# EAGLE design wordclock-mainboard (EAGLE 6.4)
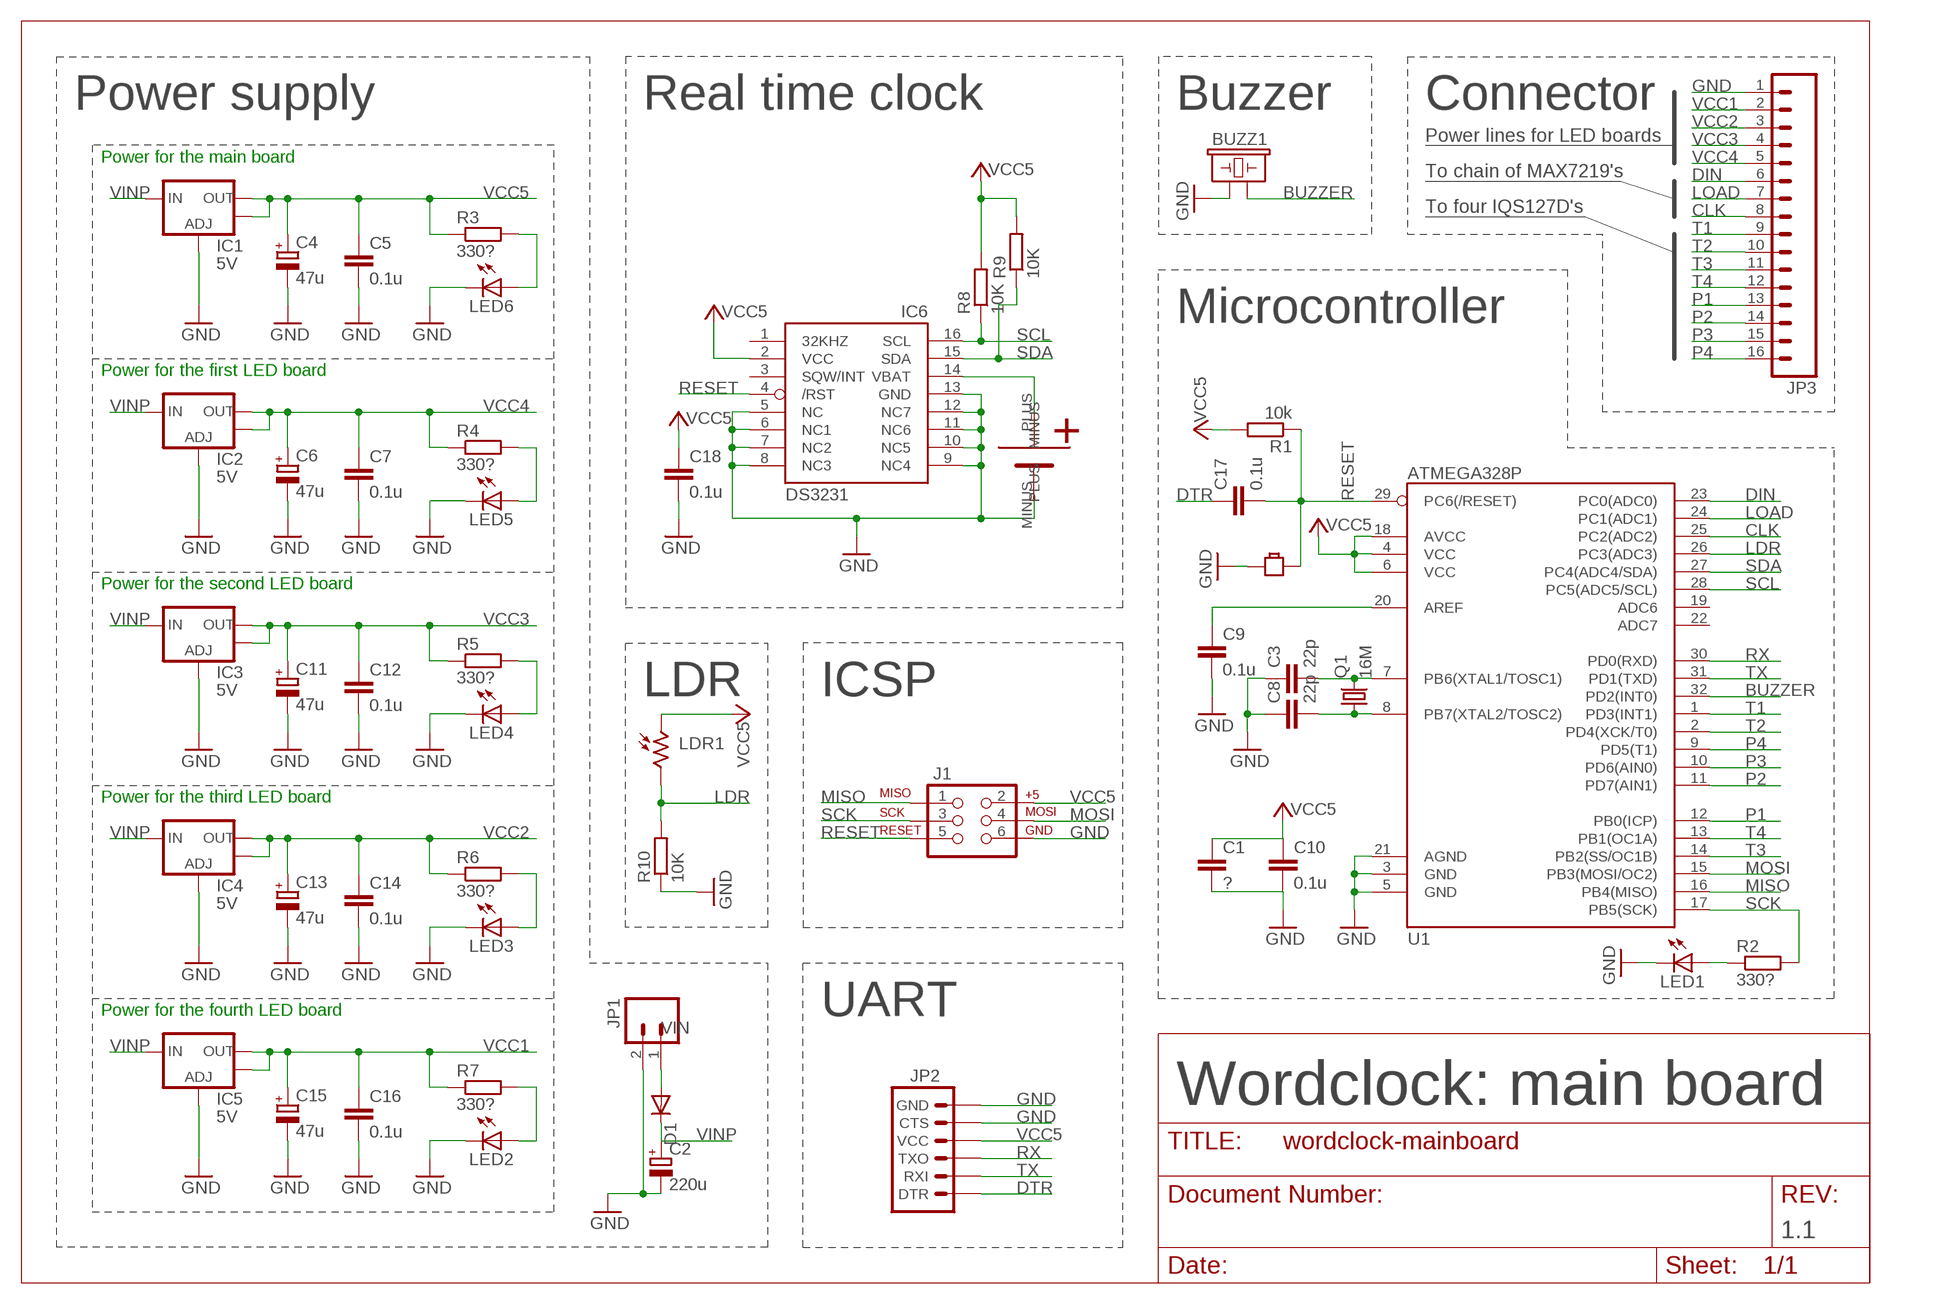
[diagram p0: schematic, sheet 1]

## Parts
BUZZ1  BUZZERPTH  [BUZZER-12MM]
C1  ?  C-EUC0805  [C0805]
C2  220u  CPOL-EUD  [PANASONIC_D]
C3  22p  C-EUC0805  [C0805]
C4  47u  CPOL-EUD  [PANASONIC_D]
C5  0.1u  C-EUC0805  [C0805]
C6  47u  CPOL-EUD  [PANASONIC_D]
C7  0.1u  C-EUC0805  [C0805]
C8  22p  C-EUC0805  [C0805]
C9  0.1u  C-EUC0805  [C0805]
C10  0.1u  C-EUC0805  [C0805]
C11  47u  CPOL-EUD  [PANASONIC_D]
C12  0.1u  C-EUC0805  [C0805]
C13  47u  CPOL-EUD  [PANASONIC_D]
C14  0.1u  C-EUC0805  [C0805]
C15  47u  CPOL-EUD  [PANASONIC_D]
C16  0.1u  C-EUC0805  [C0805]
C17  0.1u  C-EUC0805  [C0805]
C18  0.1u  C-EUC0805  [C0805]
D1  DIODE-DO-214AC  [DO-214AC]
IC1  5V  V_REG_LM1117SOT223  [SOT223]
IC2  5V  V_REG_LM1117SOT223  [SOT223]
IC3  5V  V_REG_LM1117SOT223  [SOT223]
IC4  5V  V_REG_LM1117SOT223  [SOT223]
IC5  5V  V_REG_LM1117SOT223  [SOT223]
IC6  DS3231/SO  [SO16W]
J1  AVR_SPI_PRG_6PTH  [2X3]
JP1  M02PTH  [1X02]
JP2  ARDUINO_SERIAL_PROGRAMPTH  [1X06]
JP3  M161X16_NO_SILK  [1X16_NO_SILK]
LDR1  A1050_09  [T0-46-A10XX]
LED1  LEDCHIPLED_0603  [CHIPLED_0603]
LED2  LEDCHIPLED_0603  [CHIPLED_0603]
LED3  LEDCHIPLED_0603  [CHIPLED_0603]
LED4  LEDCHIPLED_0603  [CHIPLED_0603]
LED5  LEDCHIPLED_0603  [CHIPLED_0603]
LED6  LEDCHIPLED_0603  [CHIPLED_0603]
Q1  16M  CSM-7X-DU  [CSM-7X-DU]
R1  10k  R-EU_R0603  [R0603]
R2  330?  R-EU_R0603  [R0603]
R3  330?  R-EU_R0603  [R0603]
R4  330?  R-EU_R0603  [R0603]
R5  330?  R-EU_R0603  [R0603]
R6  330?  R-EU_R0603  [R0603]
R7  330?  R-EU_R0603  [R0603]
R8  10K  R-EU_R0603  [R0603]
R9  10K  R-EU_R0603  [R0603]
R10  10K  R-EU_R0603  [R0603]
RESET  BUTTON-SMD-2P  [BUTTON_2P_SMD]
U1  ATMEGA328P  ATMEGA328_SMT  [TQFP32-08]
U$1  SMD-CR2032  [SMD-BATT]

## Nets
BUZZER: BUZZ1.- U1.32(PD2(INT0))
CLK: JP3.8 U1.25(PC2(ADC2))
DIN: JP3.6 U1.23(PC0(ADC0))
DTR: C17.1 JP2.1(DTR)
GND: BUZZ1.+ C1.2 C2.- C3.1 C4.- C5.2 C6.- C7.2 C8.1 C9.2 C10.2 C11.- C12.2 C13.- C14.2 C15.- C16.2 C18.2 IC1.1(ADJ) IC2.1(ADJ) IC3.1(ADJ) IC4.1(ADJ) IC5.1(ADJ) IC6.5(NC) IC6.6(NC1) IC6.7(NC2) IC6.8(NC3) IC6.9(NC4) IC6.10(NC5) IC6.11(NC6) IC6.12(NC7) IC6.13(GND) J1.6 JP1.2 JP2.5(CTS) JP2.6(GND) JP3.1 LED1.C LED2.C LED3.C LED4.C LED5.C LED6.C R10.1 RESET.1 U1.3(GND) U1.5(GND) U1.21(AGND) U$1.MINUS
LDR: LDR1.2 R10.2 U1.26(PC3(ADC3))
LOAD: JP3.7 U1.24(PC1(ADC1))
MISO: J1.1 U1.16(PB4(MISO))
MOSI: J1.4 U1.15(PB3(MOSI/OC2))
N$1: C3.2 Q1.2 U1.7(PB6(XTAL1/TOSC1))
N$3: C8.2 Q1.1 U1.8(PB7(XTAL2/TOSC2))
N$4: LED1.A R2.1
N$5: LED2.A R7.2
N$6: C9.1 U1.20(AREF)
N$7: LED3.A R6.2
N$8: LED4.A R5.2
N$9: LED6.A R3.2
N$10: LED5.A R4.2
N$12: IC6.14(VBAT) U$1.PLUS
P1: JP3.13 U1.12(PB0(ICP))
P2: JP3.14 U1.11(PD7(AIN1))
P3: JP3.15 U1.10(PD6(AIN0))
P4: JP3.16 U1.9(PD5(T1))
RESET: C17.2 IC6.4(/RST) J1.5 R1.1 RESET.P$2 U1.29(PC6(/RESET))
RX: JP2.3(TXO) U1.30(PD0(RXD))
SCK: J1.3 R2.2 U1.17(PB5(SCK))
SCL: IC6.16(SCL) R8.1 U1.28(PC5(ADC5/SCL))
SDA: IC6.15(SDA) R9.1 U1.27(PC4(ADC4/SDA))
T1: JP3.9 U1.1(PD3(INT1))
T2: JP3.10 U1.2(PD4(XCK/T0))
T3: JP3.11 U1.14(PB2(SS/OC1B))
T4: JP3.12 U1.13(PB1(OC1A))
TX: JP2.2(RXI) U1.31(PD1(TXD))
VCC1: C15.+ C16.1 IC5.2(OUT) IC5.4(OUT) JP3.2 R7.1
VCC2: C13.+ C14.1 IC4.2(OUT) IC4.4(OUT) JP3.3 R6.1
VCC3: C11.+ C12.1 IC3.2(OUT) IC3.4(OUT) JP3.4 R5.1
VCC4: C6.+ C7.1 IC2.2(OUT) IC2.4(OUT) JP3.5 R4.1
VCC5: C1.1 C4.+ C5.1 C10.1 C18.1 IC1.2(OUT) IC1.4(OUT) IC6.2(VCC) J1.2 JP2.4(VCC) LDR1.1 R1.2 R3.1 R8.2 R9.2 U1.4(VCC) U1.6(VCC) U1.18(AVCC)
VIN: D1.A JP1.1
VINP: C2.+ D1.C IC1.3(IN) IC2.3(IN) IC3.3(IN) IC4.3(IN) IC5.3(IN)
Unconnected: IC6.1(32KHZ) IC6.3(SQW/INT) U1.19(ADC6) U1.22(ADC7)

## Notes on the sheet
- Power supply | Real time clock | Buzzer | Connector
- Power lines for LED boards
- Power for the main board
- To chain of MAX7219's
- To four IQS127D's
- Microcontroller
- Power for the first LED board
- Power for the second LED board
- LDR | ICSP
- Power for the third LED board
- Power for the fourth LED board | UART
- Wordclock: main board
- 1.1

## Library data of the parts
BUZZ1 = SparkFun-Electromechanical:BUZZER: Buzzer 12mm Spark Fun Electronics SKU : Comp-Buzzer
C1 C3 C5 C7-C10 C12 C14 C16-C18 = rcl:C-EU: CAPACITOR, European symbol
C2 C4 C6 C11 C13 C15 = rcl:CPOL-EU: POLARIZED CAPACITOR, European symbol
D1 = diode:DIODE-: DIODE
IC1-IC5 = SparkFun-PowerIC:V_REG_LM1117: Voltage Regulator LM1117 Standard adjustable voltage regulator but in SMD form. Spark Fun Electronics SKU : COM-00595
IC6 = adafruit:DS3231
J1 = SparkFun-Connectors:AVR_SPI_PRG_6: AVR ISP 6 Pin This is the reduced ISP connector for AVR programming. Common on Arduino. This footprint will take up less PCB space and can be used with a 10-pin to 6-pin adapter such as SKU: BOB-08508
JP1 = SparkFun-Connectors:M02: Standard 2-pin 0.1" header. Use with - straight break away headers ( PRT-00116) - right angle break away headers (PRT-00553) - swiss pins (PRT-00743) - machine pins (PRT-00117) - female headers (PRT-00115) Molex polarized connector foot print use with: PRT-08233 with associated crimp pins and housings. 2.54_SCREWTERM for use with PRT-10571. 3.5mm Screw Terminal footprints for PRT-08084 5mm Screw Terminal footprints for use with PRT-08433
JP2 = SparkFun-Connectors:ARDUINO_SERIAL_PROGRAM: FTDI connector footprints
JP3 = SparkFun-Connectors:M16: 1x16 .1" header
LDR1 = photo-elements:A10: Sensor Robust Light Sensing Applications Outdoor Light Sensing Application Source: http://optoelectronics.perkinelmer.com/content/Datasheets/DTS_PhotocellsA1050.pdf
LED1-LED6 = adafruit:LED: LED OSRAM: - CHIPLED LG R971, LG N971, LY N971, LG Q971, LY Q971, LO R971, LY R971 LH N974, LH R974 LS Q976, LO Q976, LY Q976 LO Q996 - Hyper CHIPLED LW Q18S LB Q993, LB Q99A, LB R99A - SideLED LS A670, LO A670, LY A670, LG A670, LP A670 LB A673, LV A673, LT A673, LW A673 LH A674 LY A675 LS A676, LA A676, LO A676, LY A676, LW A676 LS A679, LY A679, LG A679 - Hyper Micro SIDELED® LS Y876, LA Y876, LO Y876, LY Y876 LT Y87S - SmartLED LW L88C, LW L88S LB L89C, LB L89S, LG L890 LS L89K, LO L89K, LY L89K LS L896, LA L896, LO L896, LY L896 - TOPLED LS T670, LO T670, LY T670, LG T670, LP T670 LSG T670, LSP T670, LSY T670, LOP T670, LYG T670 LG T671, LOG T671, LSG T671 LB T673, LV T673, LT T673, LW T673 LH T674 LS T676, LA T676, LO T676, LY T676, LB T676, LH T676, LSB T676, LW T676 LB T67C, LV T67C, LT T67C, LS T67K, LO T67K, LY T67K, LW E67C LS E67B, LA E67B, LO E67B, LY E67B, LB E67C, LV E67C, LT E67C LW T67C LS T679, LY T679, LG T679 LS T770, LO T770, LY T770, LG T770, LP T770 LB T773, LV T773, LT T773, LW T773 LH T774 LS E675, LA E675, LY E675, LS T675 LS T776, LA T776, LO T776, LY T776, LB T776 LHGB T686 LT T68C, LB T68C - Hyper Mini TOPLED® LB M676 - Mini TOPLED Santana® LG M470 LS M47K, LO M47K, LY M47K Source: http://www.osram.convergy.de/
Q1 = crystal:CSM-7X-DU: SMD CRYSTAL Source: www.ecsxtal.com .. Crystal 3.6864MHz CSM_7X_DU.PDF; OC_FARNELL: unknown; OC_NEWARK: unknown
R1-R10 = rcl:R-EU_: RESISTOR, European symbol
RESET = Itead_BP_110825.lbr:BUTTON-SMD-2P: BAS014
U1 = SparkFun-DigitalIC:ATMEGA328_SMT: 32-Pin Atmega328 part Commonly used on Arduino compatible boards Available in QFP and QFN packages TQFP is IC-09069 QFN is non-stock; PROD_ID: IC-09069
U$1 = Wouter-Power:SMD-CR2032

## Board
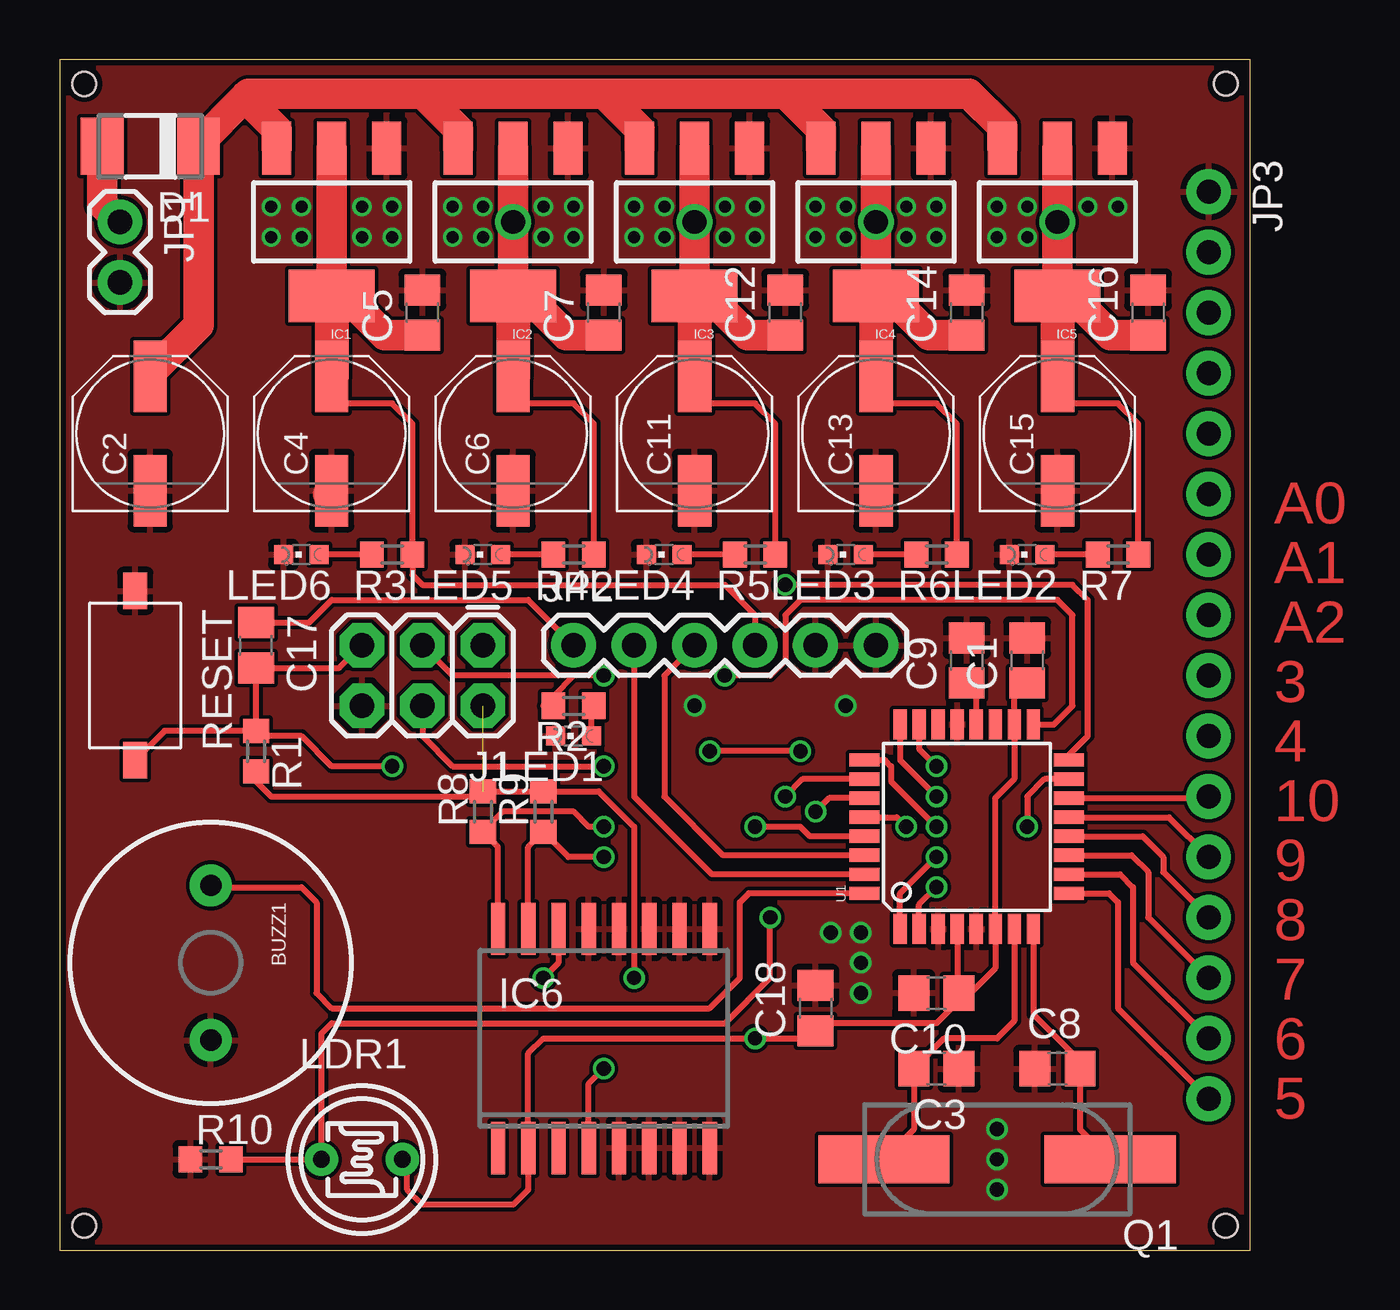
[diagram p1: board, top side]
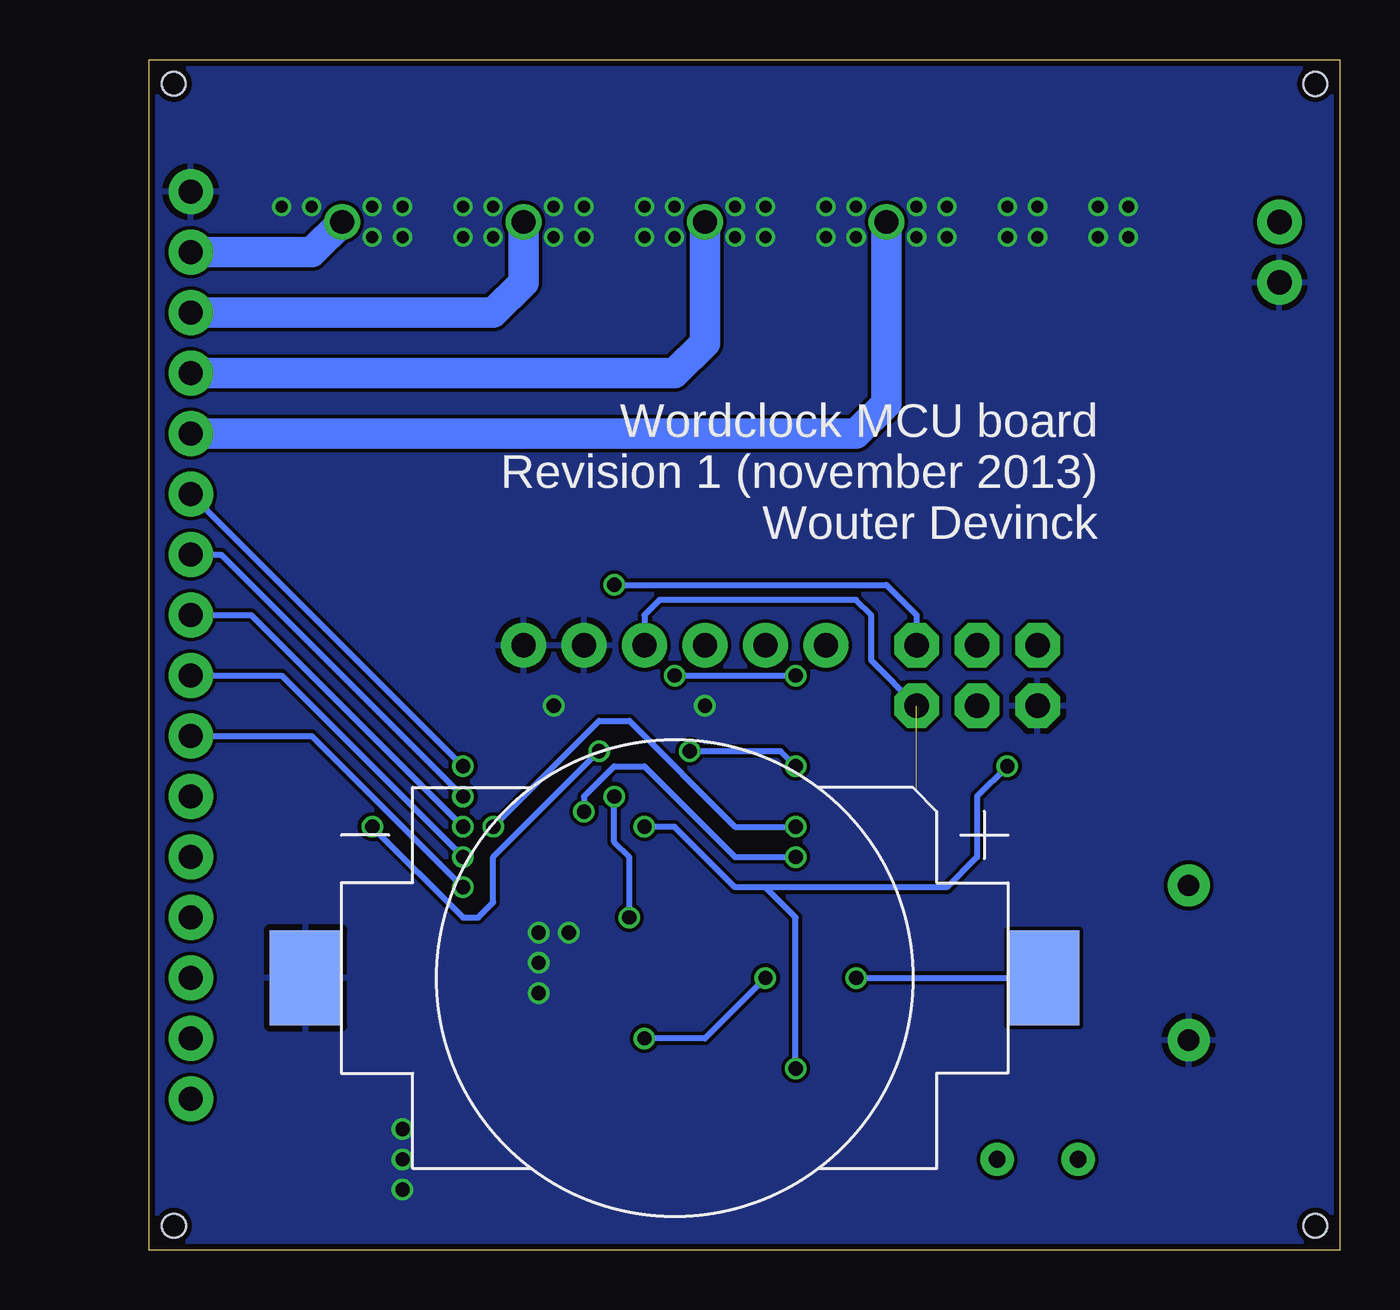
[diagram p2: board, bottom side, seen from below]

Size 50 x 50 mm. Coordinates in mm from the lower left corner, seen from the top.
Outline: 0,0 50,0 50,50 0,50 0,0
Copper layers (1*2*15*16): Top 0.035mm / dielectric 0.2mm / Route2 0.0175mm / dielectric 1.1mm / Route15 0.0175mm / dielectric 0.2mm / Bottom 0.035mm
Design rules "SeeedStudio_DRU_no_angle_20130527": minimum track width 6mil, minimum drill 12mil, track to track 6mil, track to pad 6mil, pad to pad 6mil, via to via 6mil, smd to smd 0mil, copper to edge 10mil, drill to drill 10mil, minimum pad ring 6mil, minimum via ring 6mil, stop-mask expansion 2mil, vias tented up to drill 25mil, thermal gap 10mil
Holes 1 mm at 48.97,48.98 1.03,1.02 48.97,1.02 1.03,48.98

### Footprints (pad centres in the part's own frame; a part is rotated, then mirrored left to right if it is on the bottom)
BUZZER-12MM = drill 0.9 pad 1.778: + 3.25,0; - -3.25,0
C0805 = smd 1.3 x 1.5: 1 -0.95,0; 2 0.95,0
PANASONIC_D = smd 3 x 1.4: + 2.4,0; - -2.4,0
DO-214AC = smd 1.8 x 2.4: A 2.025,0; C -2.025,0
SOT223 = smd 1.219 x 2.235: 1 -2.311,-3.099; 2 0,-3.099; 3 2.311,-3.099 | smd 3.6 x 2.2: 4 0,3.099
SO16W = smd 0.6 x 2.2: 1 -4.445,-4.6; 2 -3.175,-4.6; 3 -1.905,-4.6; 4 -0.635,-4.6; 5 0.635,-4.6; 6 1.905,-4.6; 7 3.175,-4.6; 8 4.445,-4.6; 9 4.445,4.6; 10 3.175,4.6; 11 1.905,4.6; 12 0.635,4.6; 13 -0.635,4.6; 14 -1.905,4.6; 15 -3.175,4.6; 16 -4.445,4.6
2X3 = drill 1.016 pad 1.88 octagon: 1 0,0; 2 0,2.54; 3 2.54,0; 4 2.54,2.54; 5 5.08,0; 6 5.08,2.54
1X02 = drill 1.016 pad 1.88: 1 0,0; 2 2.54,0
1X06 = drill 1.016 pad 1.88: 1 0,0; 2 2.54,0; 3 5.08,0; 4 7.62,0; 5 10.16,0; 6 12.7,0
1X16_NO_SILK = drill 1.016 pad 1.88: 1 0,0; 2 2.54,0; 3 5.08,0; 4 7.62,0; 5 10.16,0; 6 12.7,0; 7 15.24,0; 8 17.78,0; 9 20.32,0; 10 22.86,0; 11 25.4,0; 12 27.94,0; 13 30.48,0; 14 33.02,0; 15 35.56,0; 16 38.1,0
T0-46-A10XX = drill 0.7 pad 1.4: 1 -1.7,0; 2 1.7,0
CHIPLED_0603 = smd 0.8 x 0.8: A 0,-0.75; C 0,0.75
CSM-7X-DU = smd 5.5 x 2: 1 -4.75,0; 2 4.75,0
R0603 = smd 1 x 1.1: 1 -0.85,0; 2 0.85,0
BUTTON_2P_SMD = smd 1.524 x 1.016: 1 -3.556,0; P$2 3.556,0
TQFP32-08 = smd 1.27 x 0.559: 1 -4.293,2.8; 2 -4.293,2; 3 -4.293,1.2; 4 -4.293,0.4; 5 -4.293,-0.4; 6 -4.293,-1.2; 7 -4.293,-2; 8 -4.293,-2.8; 17 4.293,-2.8; 18 4.293,-2; 19 4.293,-1.2; 20 4.293,-0.4; 21 4.293,0.4; 22 4.293,1.2; 23 4.293,2; 24 4.293,2.8 | smd 0.559 x 1.27: 9 -2.8,-4.293; 10 -2,-4.293; 11 -1.2,-4.293; 12 -0.4,-4.293; 13 0.4,-4.293; 14 1.2,-4.293; 15 2,-4.293; 16 2.8,-4.293; 25 2.8,4.293; 26 2,4.293; 27 1.2,4.293; 28 0.4,4.293; 29 -0.4,4.293; 30 -1.2,4.293; 31 -2,4.293; 32 -2.8,4.293
SMD-BATT = smd 3 x 4: MINUS -15.5,0; PLUS 15.5,0

### Placement (x,y rotation side)
BUZZ1  6.35,12.06 270 top
C1  40.64,24.77 90 top
C2  3.81,34.29 90 top
C3  36.83,7.62 180 top
C4  11.43,34.29 90 top
C5  15.24,39.37 90 top
C6  19.05,34.29 90 top
C7  22.86,39.37 90 top
C8  41.91,7.62 0 top
C9  38.1,24.77 90 top
C10  36.83,10.79 180 top
C11  26.67,34.29 90 top
C12  30.48,39.37 90 top
C13  34.29,34.29 90 top
C14  38.1,39.37 90 top
C15  41.91,34.29 90 top
C16  45.72,39.37 90 top
C17  8.26,25.4 270 top
C18  31.75,10.16 90 top
D1  3.81,46.35 180 top
IC1  11.43,43.18 180 top
IC2  19.05,43.18 180 top
IC3  26.67,43.18 180 top
IC4  34.29,43.18 180 top
IC5  41.91,43.18 180 top
IC6  22.86,8.89 0 top
J1  17.78,25.4 180 top
JP1  2.54,43.18 270 top
JP2  21.59,25.4 0 top
JP3  48.26,44.45 270 top
LDR1  12.7,3.81 180 top
LED1  21.59,21.59 90 top
LED2  40.64,29.21 90 top
LED3  33.02,29.21 90 top
LED4  25.4,29.21 90 top
LED5  17.78,29.21 90 top
LED6  10.16,29.21 90 top
Q1  39.37,3.81 180 top
R1  8.26,20.95 270 top
R2  21.59,22.86 180 top
R3  13.97,29.21 180 top
R4  21.59,29.21 180 top
R5  29.21,29.21 180 top
R6  36.83,29.21 180 top
R7  44.45,29.21 180 top
R8  17.78,18.41 90 top
R9  20.32,18.41 90 top
R10  6.35,3.81 0 top
RESET  3.17,24.13 270 top
U1  38.1,17.78 90 top
U$1  27.94,11.43 0 bottom

### Tracks (layer width: path | path; a pad name or v marks a point on that pad's centre or on a via)
BUZZER
  Top 0.254: BUZZ1.- 6.35,15.24 10.16,15.24 10.79,14.61 10.79,10.79 11.43,10.16 27.3,10.16 28.57,11.43 28.57,14.61 28.95,14.98 U1.32
CLK  (via drill 0.6)
  Top 0.254: U1.25 34.66,20.58 34.92,20.32 34.92,19.68 v36.83,17.78
  Bottom 0.254: JP3.8 45.72,26.67 v36.83,17.78
DIN  (via drill 0.6)
  Top 0.254: U1.23 36.1,21.05 v36.83,20.32
  Bottom 0.254: v36.83,20.32 JP3.6
DTR
  Top 0.254: C17.1 10.47,26.35 11.43,27.3 19.68,27.3 JP2.1
GND  (via drill 0.5, 0.6)
  Top 1.27: 11.29,31.75 C4.-
  other vias: 32.38,13.34 33.66,13.34 33.66,12.06 33.66,10.79 39.37,5.08 39.37,3.81 39.37,2.54 8.89,43.81 10.16,43.81 8.89,42.55 10.16,42.55 12.7,43.81 13.97,43.81 12.7,42.55 13.97,42.55 16.51,43.81 17.78,43.81 16.51,42.55 17.78,42.55 20.32,43.81 20.32,42.55 21.59,42.55 21.59,43.81 24.13,43.81 25.4,43.81 27.94,43.81 29.21,43.81 29.21,42.55 27.94,42.55 25.4,42.55 24.13,42.55 31.75,43.81 31.75,42.55 33.02,42.55 33.02,43.81 35.56,43.81 36.83,43.81 35.56,42.55 36.83,42.55 39.37,43.81 43.18,43.81 44.45,43.81 40.64,43.81 40.64,42.55 39.37,42.55 26.67,22.86 33.02,22.86
  pour Bottom: 0,50 0,0 50,0 50,50
  pour Top: 0,0 50,0 50,50 0,50
LDR  (via drill 0.6)
  Top 0.254: R10.2 LDR1.2 11,9.1 11.43,9.53 27.94,9.53 29.84,11.43 v29.84,13.97 | U1.26 31.21,19.78 v30.48,19.05
  Bottom 0.254: v29.84,13.97 29.84,16.51 30.48,17.14 v30.48,19.05
LOAD  (via drill 0.6)
  Top 0.254: U1.24 35.3,20.58 v36.83,19.05
  Bottom 0.254: JP3.7 46.99,29.21 v36.83,19.05
MISO  (via drill 0.6)
  Top 0.254: U1.16 42.39,20.8 43.18,21.59 43.18,27.3 42.55,27.94 v30.48,27.94
  Bottom 0.254: v30.48,27.94 19.05,27.94 17.78,26.67 J1.1
MOSI  (via drill 0.6)
  Top 0.254: U1.15 41.37,19.78 40.64,19.05 v40.64,17.78 | J1.4 15.24,21.59 16.51,20.32 v22.86,20.32 | v31.11,20.95 v27.3,20.95
  Bottom 0.254: v40.64,17.78 36.83,13.97 36.2,13.97 35.56,14.61 35.56,16.51 v31.11,20.95 | v27.3,20.95 23.5,20.95 v22.86,20.32
N$1
  Top 0.254: Q1.2 35.88,5.07 C3.2 37.15,8.89 39.37,8.89 40.1,9.62 U1.7
N$3
  Top 0.254: Q1.1 42.86,5.07 C8.2 42.86,7.94 40.9,9.9 U1.8
N$4
  Top 0.254: LED1.A 22.34,22.76 R2.1
N$5
  Top 0.254: R7.2 LED2.A
N$6
  Top 0.254: U1.20 38.5,24.05 C9.1
N$7
  Top 0.254: R6.2 LED3.A
N$8
  Top 0.254: R5.2 LED4.A
N$9
  Top 0.254: R3.2 LED6.A
N$10
  Top 0.254: R4.2 LED5.A
N$12  (via drill 0.6)
  Top 0.254: IC6.14 20.95,12.06 v20.32,11.43
  Bottom 0.254: v20.32,11.43 U$1.PLUS
P1
  Top 0.254: U1.12 45.48,17.38 46.35,16.51 46.35,15.88 JP3.13
P2
  Top 0.254: U1.11 45.02,16.58 45.72,15.88 45.72,13.97 JP3.14
P3
  Top 0.254: U1.10 44.55,15.78 45.09,15.24 45.09,12.06 JP3.15
P4
  Top 0.254: U1.9 44.08,14.98 44.45,14.61 44.45,10.16 JP3.16
RESET  (via drill 0.6)
  Top 0.254: 3.56,20.57 RESET.P$2 4.41,21.8 R1.1 | R1.1 C17.2 11.75,24.45 J1.5 | IC6.4 22.23,6.99 v22.86,7.62 | v13.97,20.32 11.43,20.32 10.16,21.59 8.47,21.59 R1.1 | U1.29 31.52,17.38 31.11,17.78 v29.21,17.78
  Bottom 0.254: v13.97,20.32 15.24,19.05 15.24,16.51 16.51,15.24 24.13,15.24 | 24.13,15.24 25.4,15.24 27.94,17.78 v29.21,17.78 | v22.86,7.62 22.86,13.97 24.13,15.24
RX
  Top 0.254: U1.30 27.87,16.58 25.4,19.05 25.4,24.13 JP2.3
SCK  (via drill 0.6)
  Top 0.254: 20.32,22.86 R2.2 20.74,23.28 21.59,24.13 | 21.59,24.13 16.51,24.13 J1.3 | U1.17 41.76,22.07 42.55,22.86 42.55,26.67 41.91,27.3 31.11,27.3 30.48,26.67 30.48,24.77 29.84,24.13 v27.94,24.13 | v22.86,24.13 21.59,24.13
  Bottom 0.254: v27.94,24.13 v22.86,24.13
SCL  (via drill 0.6)
  Top 0.254: R8.1 17.78,17.78 | IC6.16 18.41,16.93 R8.1 | U1.28 35.16,18.18 v35.56,17.78 | v22.86,17.78 22.23,17.78 21.59,18.41 18.63,18.41 R8.1
  Bottom 0.254: v35.56,17.78 31.11,22.23 29.84,22.23 25.4,17.78 v22.86,17.78
SDA  (via drill 0.6)
  Top 0.254: IC6.15 19.68,16.93 R9.1 21.38,16.51 v22.86,16.51 | U1.27 32.31,18.98 v31.75,18.41
  Bottom 0.254: v22.86,16.51 25.4,16.51 29.21,20.32 30.48,20.32 31.75,19.05 v31.75,18.41
T1  (via drill 0.6)
  Top 0.254: U1.1 35.3,14.98 v36.83,16.51
  Bottom 0.254: JP3.9 44.45,24.13 v36.83,16.51
T2  (via drill 0.6)
  Top 0.254: U1.2 36.1,14.51 v36.83,15.24
  Bottom 0.254: JP3.10 43.18,21.59 v36.83,15.24
T3
  Top 0.254: U1.14 48.19,18.98 JP3.11
T4
  Top 0.254: U1.13 46.59,18.18 JP3.12
TX
  Top 0.254: U1.31 27.4,15.78 24.13,19.05 JP2.2
VCC1  (via drill 1)
  Top 0.254: R7.1 45.3,34.71 44.45,35.56 41.91,35.56
  Top 0.305: C15.+ 41.91,35.56
  Top 1.27: IC5.2 v41.91,43.18 41.91,40.64 | IC5.4 41.91,40.64 | C16.1 44.13,38.42 41.91,40.64
  Top 1.422: IC5.4 C15.+
  Bottom 1.27: JP3.2 43.18,41.91 v41.91,43.18
VCC2  (via drill 1)
  Top 0.254: R6.1 37.68,34.71 36.83,35.56 34.29,35.56 C13.+
  Top 1.27: IC4.2 v34.29,43.18 34.29,40.64 | 34.29,40.64 IC4.4 | C14.1 36.51,38.42 34.29,40.64
  Top 1.422: IC4.4 C13.+
  Bottom 1.27: JP3.3 35.56,39.37 34.29,40.64 v34.29,43.18
VCC3  (via drill 1)
  Top 0.254: R5.1 30.06,34.71 29.21,35.56 26.67,35.56 C11.+
  Top 1.27: IC3.2 v26.67,43.18 26.67,40.64 | 26.67,40.64 IC3.4 | C12.1 28.89,38.42 26.67,40.64
  Top 1.422: IC3.4 C11.+
  Bottom 1.27: JP3.4 27.94,36.83 26.67,38.1 v26.67,43.18
VCC4  (via drill 1)
  Top 0.254: R4.1 22.44,34.71 21.59,35.56 19.05,35.56 C6.+
  Top 1.27: IC2.2 v19.05,43.18 19.05,40.64 | 19.05,40.64 IC2.4 | C7.1 21.27,38.42 19.05,40.64
  Top 1.422: IC2.4 C6.+
  Bottom 1.27: JP3.5 20.32,34.29 19.05,35.56 v19.05,43.18
VCC5  (via drill 0.6)  (1 unrouted)
  Top 0.254: C4.+ 11.43,35.56 13.97,35.56 14.82,34.71 R3.1 14.82,28.36 15.24,27.94 27.94,27.94 29.21,26.67 JP2.4 | 37.7,10.24 C10.1 37.7,10.88 U1.4 | R1.2 8.26,19.68 8.89,19.05 17.57,19.05 R8.2 R9.2 22.64,19.27 24.13,17.78 v24.13,11.43 | LDR1.1 14.61,3.6 14.61,2.54 15.24,1.91 19.05,1.91 19.68,2.54 IC6.2 19.68,8.26 20.32,8.89 v29.21,8.89 31.43,8.89 C18.1 32.06,9.53 36.83,9.53 37.55,10.24 37.7,10.24 | 37.7,10.24 39.3,11.84 U1.6 39.3,18.98 40.1,19.78 U1.18 40.1,23.91 C1.1
  Top 1.27: IC1.2 11.43,40.64 | 11.43,40.64 IC1.4 | C5.1 13.65,38.42 11.43,40.64
  Top 1.422: IC1.4 C4.+
  Bottom 0.254: J1.2 19.68,24.77 19.68,26.67 20.32,27.3 28.57,27.3 29.21,26.67 JP2.4 | v24.13,11.43 26.67,8.89 v29.21,8.89
VIN
  Top 1.27: D1.A 1.78,43.94 JP1.1
VINP
  Top 1.27: 15.24,48.57 22.86,48.57 | 22.86,48.57 30.48,48.57 | 30.48,48.57 38.2,48.57 39.6,47.17 IC5.3 | IC4.3 31.98,47.07 30.48,48.57 | IC3.3 24.36,47.07 22.86,48.57 | IC2.3 16.74,47.07 15.24,48.57 | IC1.3 9.12,47.07 7.78,48.42 | 15.24,48.57 7.93,48.57 7.78,48.42 | 7.78,48.42 5.83,46.48 D1.C 5.83,38.85 3.81,36.83 C2.+

### Text on the board
Top: A0 | A1 | A2 | 3 | 4 | 10 | 9 | 8 | 7 | 6 | 5
bNames: Wordclock MCU board / Revision 1 (november 2013) / Wouter Devinck